# Altium schematic sheet Sheet1.SchDoc
size A2
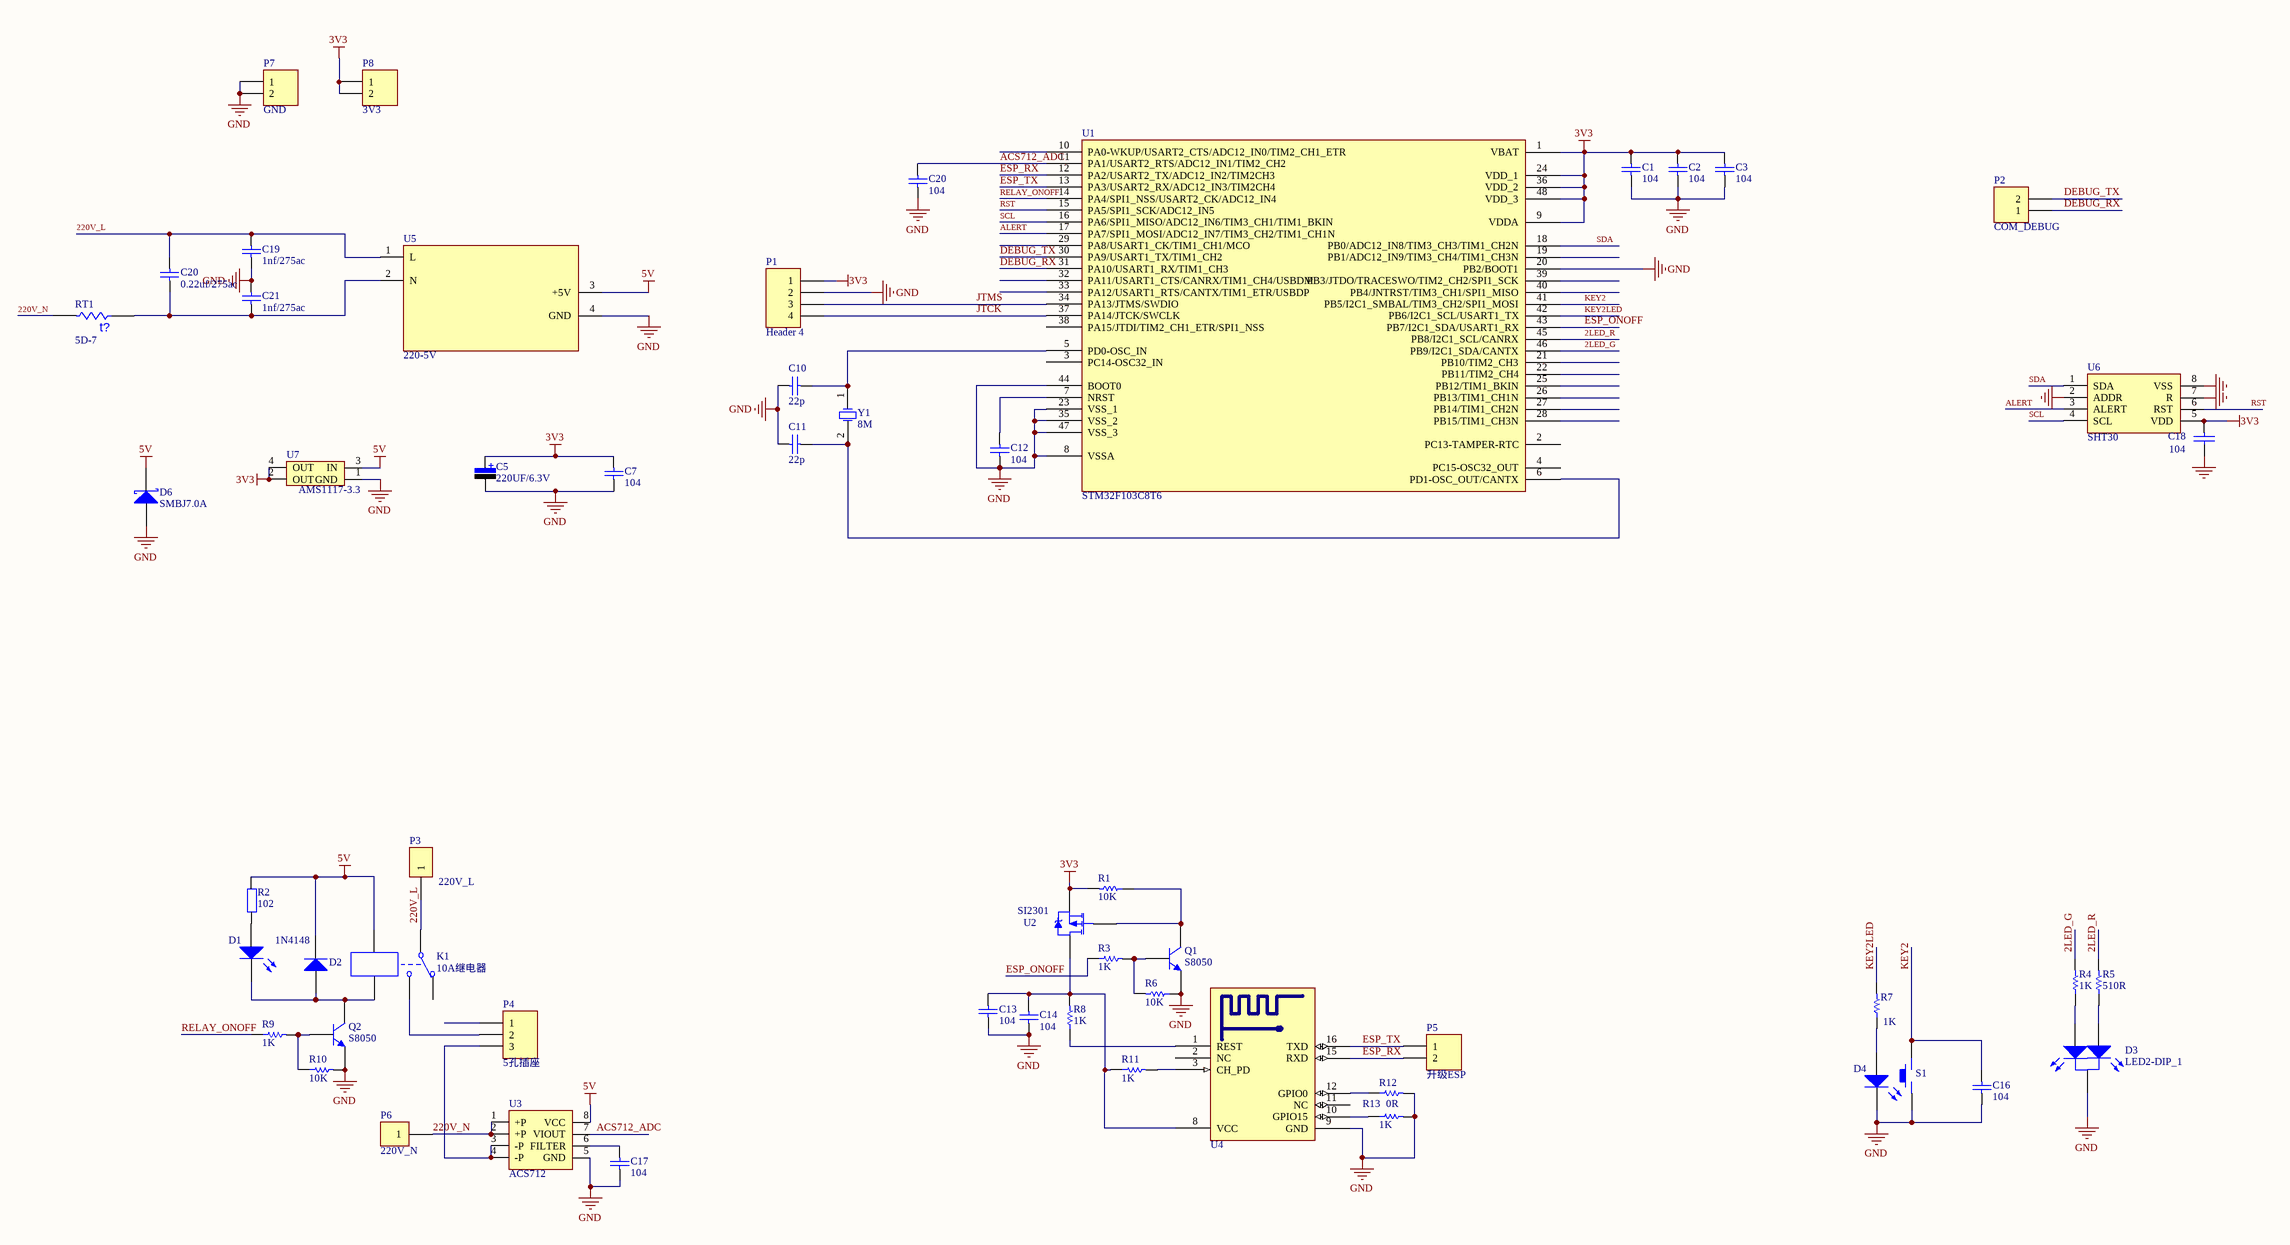
[diagram p0: Sheet1.SchDoc]

## Parts
(Parts that share a designator on the sheet are numbered #1, #2 ... from top to bottom, then left to right.)
C1  104  [0603_C]
C2  104  [0603_C]
C3  104  [0603_C]
C5  220UF/6.3V  [CC6.56.5]
C7  104  [0603_C]
C10  22p  [0603_C]
C11  22p  [0603_C]
C12  104  [0603_C]
C13  104  [0603_C]
C14  104  [0603_C]
C16  104  [0603_C]
C17  104  [0603_C]
C18  104  [0603_C]
C19  1nf/275ac  [C-RAD-7.5]
C20#1  104  [0603_C]
C20#2  0.22uf/275ac  [275VAC/0.22uf]
C21  1nf/275ac  [C-RAD-7.5]
D1  LED0  [0805_LED_S1]  (value not drawn)
D2  1N4148  [LL-34]
D3  LED2-DIP_1  [LED-A3]
D4  LED0  [0805_LED_S1]  (value not drawn)
D6  SMBJ7.0A  [SMB(DO-214AA)_S1]
K1  10A继电器  [SPDT-5]
P1  Header 4  [HDR2.54_4X1]
P2  COM_DEBUG  [HDR2.54_2x1]
P3  220V_L  [HDR1]
P4  5孔插座  [HDRFiveholesochet]
P5  升级ESP  [HDR2.54_2x1]
P6  220V_N  [HDR1]
P7  GND  [HDR2.54_2x1]
P8  3V3  [HDR2.54_2x1]
Q1  S8050  [SOT-23]
Q2  S8050  [SOT-23]
R1  10K  [0805_R]
R2  102  [0805_R]
R3  1K  [0805_R]
R4  1K  [0805_R]
R5  510R  [0805_R]
R6  10K  [0805_R]
R7  1K  [0805_R]
R8  1K  [0805_R]
R9  1K  [0805_R]
R10  10K  [0805_R]
R11  1K  [0805_R]
R12  0R  [0805_R]
R13  1K  [0805_R]
RT1  5D-7  [RES-DIP_5mm]
S1  KEY_M  [KEY_M]  (value not drawn)
U1  STM32F103C8T6  [LQFP-48_7x7x05P]
U2  SI2301  [SI2301]
U3  ACS712  [SOP-8]
U4  ESP-12DIP  [ESP_12DIP]  (value not drawn)
U5  220-5V  [220V-5V]
U6  SHT30  [SHT30]
U7  AMS1117-3.3  [SOT-223]
Y1  8M  [XTAL_US]

## Nets
3V3: C1.1 C2.1 C3.1 C5.1 C7.2 C18.1 P1.1 P8.1 P8.2 R1.2 U1.1(VBAT) U1.9(VDDA) U1.24(VDD_1) U1.36(VDD_2) U1.48(VDD_3) U2.2(S) U6.5(VDD) U7.2(OUT) U7.4(OUT)
5V: D2.2(K) D6.1(K) K1.1 R2.2 U3.8(VCC) U5.3(+5V) U7.3(IN)
GND: C1.2 C2.2 C3.2 C5.2 C7.1 C10.2 C11.2 C12.2 C13.1 C14.1 C16.1 C17.1 C18.2 C19.2 C20#1.1 C21.1 D3.2(A) D4.K D6.2(A) P1.2 P7.1 P7.2 Q1.2(E) Q2.2(E) R6.1 R10.2 R12.2 R13.2 S1.1 U1.8(VSSA) U1.20(PB2/BOOT1) U1.23(VSS_1) U1.35(VSS_2) U1.44(BOOT0) U1.47(VSS_3) U3.5(GND) U4.9(GND) U5.4(GND) U6.2(ADDR) U6.7(R) U6.8(VSS) U7.1(GND)
2LED_G: R4.2 U1.46(PB9/I2C1_SDA/CANTX)
2LED_R: R5.2 U1.45(PB8/I2C1_SCL/CANRX)
220V_L: C19.1 C20#2.1 K1.3 P3.1 U5.1(L)
220V_N: P6.1 RT1.2 U3.1(+P) U3.2(+P)
ACS712_ADC: C20#1.2 U1.11(PA1/USART2_RTS/ADC12_IN1/TIM2_CH2) U3.7(VIOUT)
ALERT: U1.17(PA7/SPI1_MOSI/ADC12_IN7/TIM3_CH2/TIM1_CH1N) U6.3(ALERT)
DEBUG_RX: P2.1 U1.31(PA10/USART1_RX/TIM1_CH3)
DEBUG_TX: P2.2 U1.30(PA9/USART1_TX/TIM1_CH2)
ESP_ONOFF: R3.1 U1.43(PB7/I2C1_SDA/USART1_RX)
ESP_RX: P5.2 U1.12(PA2/USART2_TX/ADC12_IN2/TIM2CH3) U4.15(RXD)
ESP_TX: P5.1 U1.13(PA3/USART2_RX/ADC12_IN3/TIM2CH4) U4.16(TXD)
JTCK: P1.4 U1.37(PA14/JTCK/SWCLK)
JTMS: P1.3 U1.34(PA13/JTMS/SWDIO)
KEY2: C16.2 S1.2 U1.41(PB5/I2C1_SMBAL/TIM3_CH2/SPI1_MOSI)
KEY2LED: R7.2 U1.42(PB6/I2C1_SCL/USART1_TX)
RELAY_ONOFF: R9.1 U1.14(PA4/SPI1_NSS/USART2_CK/ADC12_IN4)
RST: U1.15(PA5/SPI1_SCK/ADC12_IN5) U6.6(RST)
SCL: U1.16(PA6/SPI1_MISO/ADC12_IN6/TIM3_CH1/TIM1_BKIN) U6.4(SCL)
SDA: U1.18(PB0/ADC12_IN8/TIM3_CH3/TIM1_CH2N) U6.1(SDA)
NetC10_1: C10.1 U1.5(PD0-OSC_IN) Y1.1(OSC1)
NetC11_1: C11.1 U1.6(PD1-OSC_OUT/CANTX) Y1.2(OSC2)
NetC12_1: C12.1 U1.7(NRST)
NetC13_2: C13.2 C14.2 R8.2 R11.1 U2.3(D) U4.8(VCC)
NetC17_2: C17.2 U3.6(FILTER)
NetC20#2_2: C20#2.2 C21.2 RT1.1 U5.2(N)
NetD1_A: D1.A R2.1
NetD1_K: D1.K D2.1(A) K1.2 Q2.3(C)
NetD3_1: D3.1(K1) R5.1
NetD3_3: D3.3(K2) R4.1
NetD4_A: D4.A R7.1
NetK1_5: K1.5 P4.2
NetP4_3: P4.3 U3.3(-P) U3.4(-P)
NetQ1_1: Q1.1(B) R3.2 R6.2
NetQ1_3: Q1.3(C) R1.1 U2.1(G)
NetQ2_1: Q2.1(B) R9.2 R10.1
NetR8_1: R8.1 U4.1(REST)
NetR11_2: R11.2 U4.3(CH_PD)
NetR12_1: R12.1 U4.12(GPIO0)
NetR13_1: R13.1 U4.10(GPIO15)

Not connected (* = marked no-connect by the designer): K1 4; P4 1; U1 2(PC13-TAMPER-RTC) 3(PC14-OSC32_IN) 4(PC15-OSC32_OUT) 10(PA0-WKUP/USART2_CTS/ADC12_IN0/TIM2_CH1_ETR) 19(PB1/ADC12_IN9/TIM3_CH4/TIM1_CH3N) 21(PB10/TIM2_CH3) 22(PB11/TIM2_CH4) 25(PB12/TIM1_BKIN) 26(PB13/TIM1_CH1N) 27(PB14/TIM1_CH2N) 28(PB15/TIM1_CH3N) 29(PA8/USART1_CK/TIM1_CH1/MCO) 32(PA11/USART1_CTS/CANRX/TIM1_CH4/USBDM) 33(PA12/USART1_RTS/CANTX/TIM1_ETR/USBDP) 38(PA15/JTDI/TIM2_CH1_ETR/SPI1_NSS) 39(PB3/JTDO/TRACESWO/TIM2_CH2/SPI1_SCK) 40(PB4/JNTRST/TIM3_CH1/SPI1_MISO); U4 2(NC) 11(NC)

## Notes on the sheet
- (in symbol Res Thermal) t?

## Library data of the parts
C1-C3 C10-C12 C20#2 = Cap: Capacitor; Published: 8-Jun-2000; LatestRevisionDate: 17-Jul-2002; LatestRevisionNote: Re-released for DXP Platform.; PackageReference: RAD-0.3; Publisher: Altium Limited; PackageDescription: Radial Cap, Thru-Hole; 2 Leads; 0.3 in Pin Spacing
  C1-C3 C12: Value: 104
  C10 C11: Value: 22p
  C20#2: Value: 0.22uf/275ac
C5 = CAP-POL: 极性电容SMD; Vol: 16V; Value: ？; Published: 8-Jun-2000; LatestRevisionDate: 17-Jul-2002; LatestRevisionNote: Re-released for DXP Platform.; PackageReference: RB7.6-15; Publisher: Altium Limited
C7 C13 C14 C16 C17 C20#1 = CAP: 无极电容SMD; Published: 8-Jun-2000; LatestRevisionDate: 17-Jul-2002; LatestRevisionNote: Re-released for DXP Platform.; PackageReference: RAD-0.3; Publisher: Altium Limited; Value: ?
C18 = CAP: Capacitor
C19 C21 = Cap: Capacitor; Value: 1nf/250vac; Published: 8-Jun-2000; LatestRevisionDate: 17-Jul-2002; LatestRevisionNote: Re-released for DXP Platform.; PackageReference: RAD-0.3; Publisher: Altium Limited; PackageDescription: Radial Cap, Thru-Hole; 2 Leads; 0.3 in Pin Spacing
D1 D4 = LED0: Typical INFRARED GaAs LED; Published: 8-Jun-2000; LatestRevisionDate: 08-Jul-2005; LatestRevisionNote: Mech Layer 1 removed.; PackageReference: LED-0; Publisher: Altium Limited; PackageDescription: LED; 2 Leads
D2 = DIODE-SMD: 二极管SMD; Published: 8-Jun-2000; LatestRevisionDate: 17-Jul-2002; LatestRevisionNote: Re-released for DXP Platform.; PackageVersion: Sep-1996; PackageReference: SMC; Publisher: Altium Limited; Code_JEDEC: DO-214-AB
D3 = LED2-DIP_1: 共阴双色LED; Published: 8-Jun-2000; LatestRevisionDate: 08-Jul-2005; LatestRevisionNote: Mech Layer 1 removed.; PackageReference: LED-0; Publisher: Altium Limited
D6 = Diode 18TQ045: Schottky Rectifier; Note: Terminal 2 is the TAB and is electrically connected to the cathode; Published: 8-Jun-2000; LatestRevisionDate: 17-Jul-2002; LatestRevisionNote: Re-released for DXP Platform.; DatasheetVersion: Dec-1997; PackageVersion: Feb-1998; PackageReference: TO-220AC; Publisher: Altium Limited; PackageDescription: TO, Thru-Hole, Vertical, Heatsink Mounted; 3 In-Line Leads (1 Absent); Pitch 2.54 mm; ComponentLink1Description: Manufacturer Link; ComponentLink1URL: http://www.irf.com/; ComponentLink2Description: Datasheet; ComponentLink2URL: http://www.irf.com/product-info/datasheets/data/18tq.pdf
K1 = Relay-SPDT-2: 单杆单掷继电器普通用; Published: 24-Mar-1999; LatestRevisionDate: 17-Jul-2002; LatestRevisionNote: Re-released for DXP Platform.; PackageReference: DIP-P8; Publisher: Altium Limited
P1 = Header 4: Header, 4-Pin; LatestRevisionDate: 17-Jul-2002; LatestRevisionNote: Re-released for DXP Platform.; Publisher: Altium Limited
P2 P5 P7 P8 = Header 2X1: 单排针; LatestRevisionDate: 17-Jul-2002; LatestRevisionNote: Re-released for DXP Platform.; Publisher: Altium Limited
P3 P6 = Header 1X1: 单排针; LatestRevisionDate: 17-Jul-2002; LatestRevisionNote: Re-released for DXP Platform.; Publisher: Altium Limited
P4 = Header 3X1: 单排针; LatestRevisionDate: 17-Jul-2002; LatestRevisionNote: Re-released for DXP Platform.; Publisher: Altium Limited
Q1 Q2 = 2N8050: NPN三极管
R1 R3-R13 = RES: 电阻SMD; Published: 8-Jun-2000; LatestRevisionDate: 17-Jul-2002; LatestRevisionNote: Re-released for DXP Platform.; PackageReference: AXIAL-0.3; Publisher: Altium Limited; Value: ?
R2 = R_2
RT1 = Res Thermal: Thermistor; Published: 24-Mar-1999; LatestRevisionDate: 29-May-2009; LatestRevisionNote: IPC-7351 Footprint Added.; PackageVersion: Mar-2003; PackageReference: 6-0805; Publisher: Altium Limited; PackageDescription: Chip Resistor 0805 Case Size; Code_IPC: RESC2012
U1 = stm32f103v8t6
U2 = SI2301: PMOS开关管
U3 = ACS712: ACS712电流检测IC
U5 = AD-DC
U7 = AMS1117
Y1 = XTAL: Crystal Oscillator; Published: 8-Jun-2000; LatestRevisionDate: 17-Jul-2002; LatestRevisionNote: Re-released for DXP Platform.; PackageReference: R38; Publisher: Altium Limited; PackageDescription: Crystal, Thru-Hole; 2 Leads; Body 3.1 x 8.2 mm (Dia.xH)